# EAGLE schematic gps_fe_v3 (EAGLE 7.5.0)
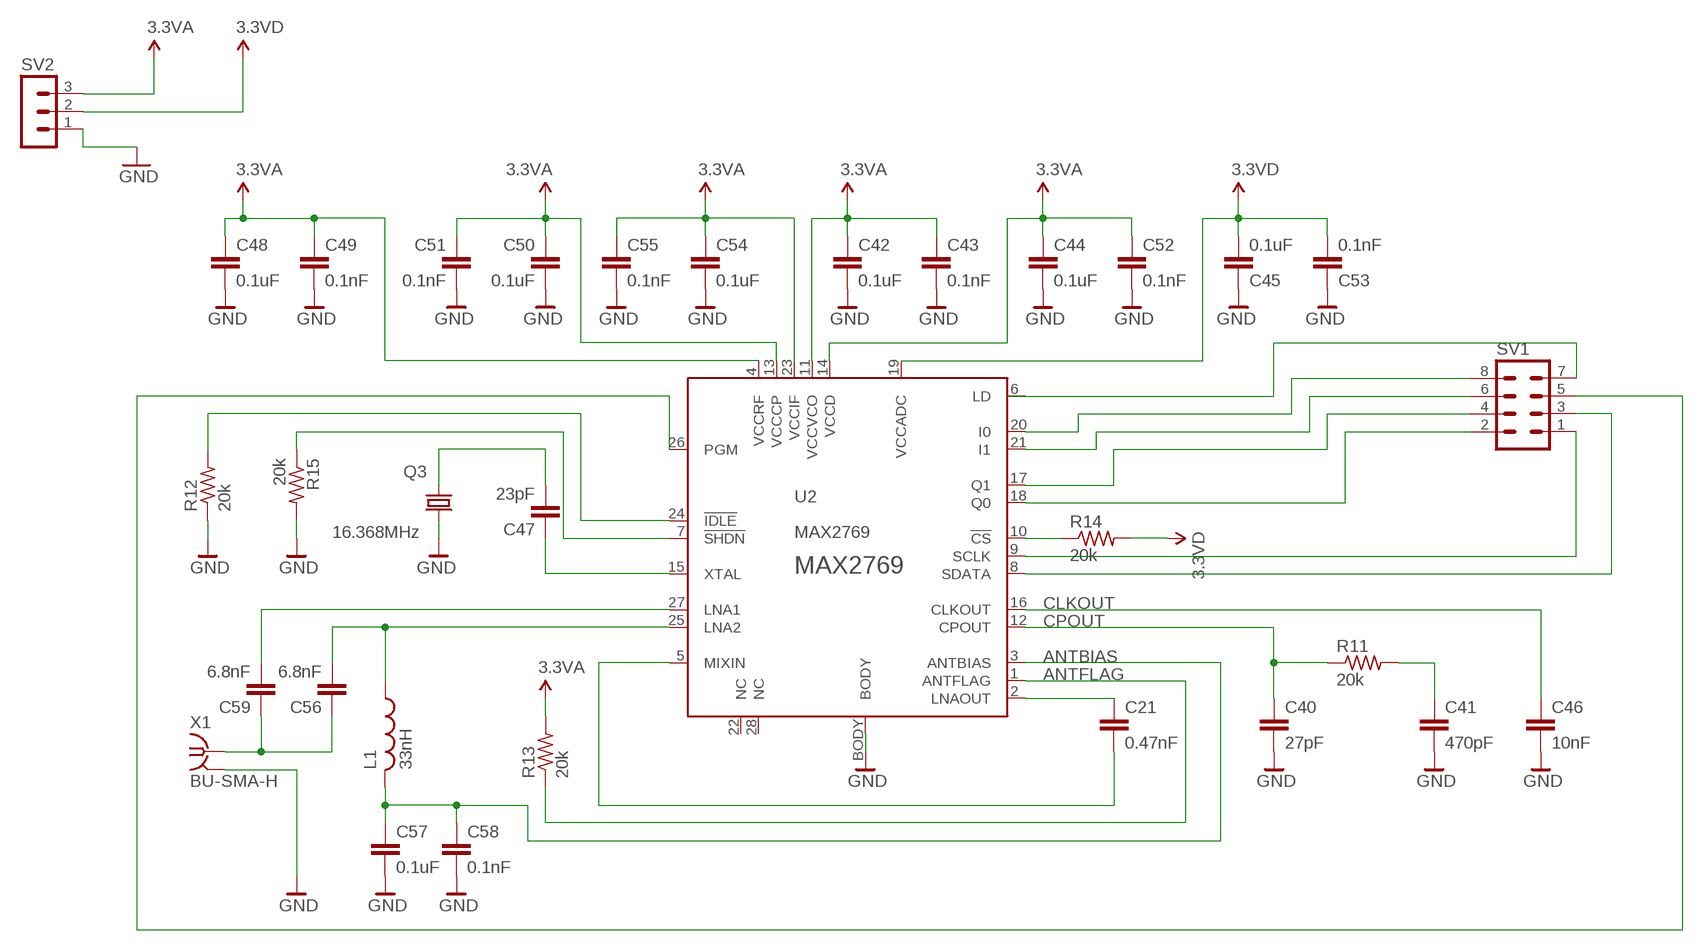
[diagram p0: schematic, sheet 1]

## Parts
C21  0.47nF  C-EUC0402  [C0402]
C40  27pF  C-EUC0402  [C0402]
C41  470pF  C-EUC0402  [C0402]
C42  0.1uF  C-EUC0402  [C0402]
C43  0.1nF  C-EUC0402  [C0402]
C44  0.1uF  C-EUC0402  [C0402]
C45  0.1uF  C-EUC0402  [C0402]
C46  10nF  C-EUC0402  [C0402]
C47  23pF  C-EUC0402  [C0402]
C48  0.1uF  C-EUC0402  [C0402]
C49  0.1nF  C-EUC0402  [C0402]
C50  0.1uF  C-EUC0402  [C0402]
C51  0.1nF  C-EUC0402  [C0402]
C52  0.1nF  C-EUC0402  [C0402]
C53  0.1nF  C-EUC0402  [C0402]
C54  0.1uF  C-EUC0402  [C0402]
C55  0.1nF  C-EUC0402  [C0402]
C56  6.8nF  C-EUC0402  [C0402]
C57  0.1uF  C-EUC0402  [C0402]
C58  0.1nF  C-EUC0402  [C0402]
C59  6.8nF  C-EUC0402  [C0402]
L1  33nH  L-US0402-A  [0402-A]
Q3  16.368MHz  CRYSTALCTS406  [CTS406]
R11  20k  R-US_R0402  [R0402]
R12  20k  R-US_R0402  [R0402]
R13  20k  R-US_R0402  [R0402]
R14  20k  R-US_R0402  [R0402]
R15  20k  R-US_R0402  [R0402]
SV1  MA04-2  [MA04-2]
SV2  MA03-1  [MA03-1]
U2  MAX2769  [90-0023]
X1  BU-SMA-H  [BU-SMA-H]

## Nets
3.3VA: C42.1 C43.1 C44.1 C48.1 C49.1 C50.1 C51.1 C52.1 C54.1 C55.1 R13.2 SV2.3 U2.4(VCCRF) U2.11(VCCVCO) U2.13(VCCCP) U2.14(VCCD) U2.23(VCCIF)
3.3VD: C45.2 C53.2 R14.2 SV2.2 U2.19(VCCADC)
ANTBIAS: C57.1 C58.1 L1.2 U2.3(ANTBIAS)
ANTFLAG: R13.1 U2.1(ANTFLAG)
BAR_GND: C40.2 C41.2 C42.2 C43.2 C44.2 C45.1 C46.2 C48.2 C49.2 C50.2 C51.2 C52.2 C53.1 C54.2 C55.2 C57.2 C58.2 Q3.3 R12.1 R15.2 U2.BODY X1.2(GND) ; supply symbol labelled GND
CLKOUT: C46.1 U2.16(CLKOUT)
CPOUT: C40.1 R11.1 U2.12(CPOUT)
GND: SV2.1
LNA3: C59.2 U2.27(LNA1)
LNA4: C56.2 L1.1 U2.25(LNA2)
LNAOUT1: C21.1 U2.2(LNAOUT)
N$1: SV1.5 U2.26(PGM)
N$2: C41.1 R11.2
N$3: SV1.7
N$4: SV1.8 U2.20(I0)
N$5: SV1.6 U2.21(I1)
N$6: SV1.4 U2.17(Q1)
N$7: R14.1 U2.10(!CS)
N$8: SV1.2 U2.18(Q0)
N$9: SV1.1 U2.9(SCLK)
N$10: SV1.3 U2.8(SDATA)
N$14: C47.2 Q3.1
N$15: C56.1 C59.1 X1.1
N$16: R15.1 U2.7(!SHDN)
N$17: R12.2 U2.24(!IDLE)
N$19: C21.2 U2.5(MIXIN)
N$20: C47.1 U2.15(XTAL)
Unconnected: U2.6(LD) U2.22(NC) U2.28(NC)

## Power pins joined to a net without a drawn wire
GND: X1.3(GND) X1.4(GND) X1.5(GND)

## Library data of the parts
C21 C40-C59 = rcl:C-EU: CAPACITOR, European symbol
L1 = rcl_custom:L-US: INDUCTOR, American symbol
Q3 = crystal:CRYSTAL: CRYSTAL; OC_FARNELL: unknown; OC_NEWARK: unknown
R11-R15 = rcl:R-US_: RESISTOR, American symbol
SV1 = con-lstb:MA04-2: PIN HEADER; OC_FARNELL: unknown; OC_NEWARK: unknown
SV2 = con-lstb:MA03-1: PIN HEADER; OC_FARNELL: unknown; OC_NEWARK: unknown
U2 = wicker:MAX2769: MAX2769 Universal GPS Receiver IC Package Land Pattern [T2855-3/T2855-3+] http://pdfserv.maxim-ic.com/land_patterns/90-0023.PDF Thin Quad Flatpack, No Leads http://pdfserv.maxim-ic.com/package_dwgs/21-0140.PDF Related Datasheet http://www.maxim-ic.com/datasheet/index.mvp/id/5241
X1 = con-coax:BU-SMA-H: FEMALE SMA CONNECTOR Radiall; OC_FARNELL: unknown; OC_NEWARK: unknown